# EAGLE board hackeeg-shield (EAGLE 9.5.2)
PCB Matrix Packages
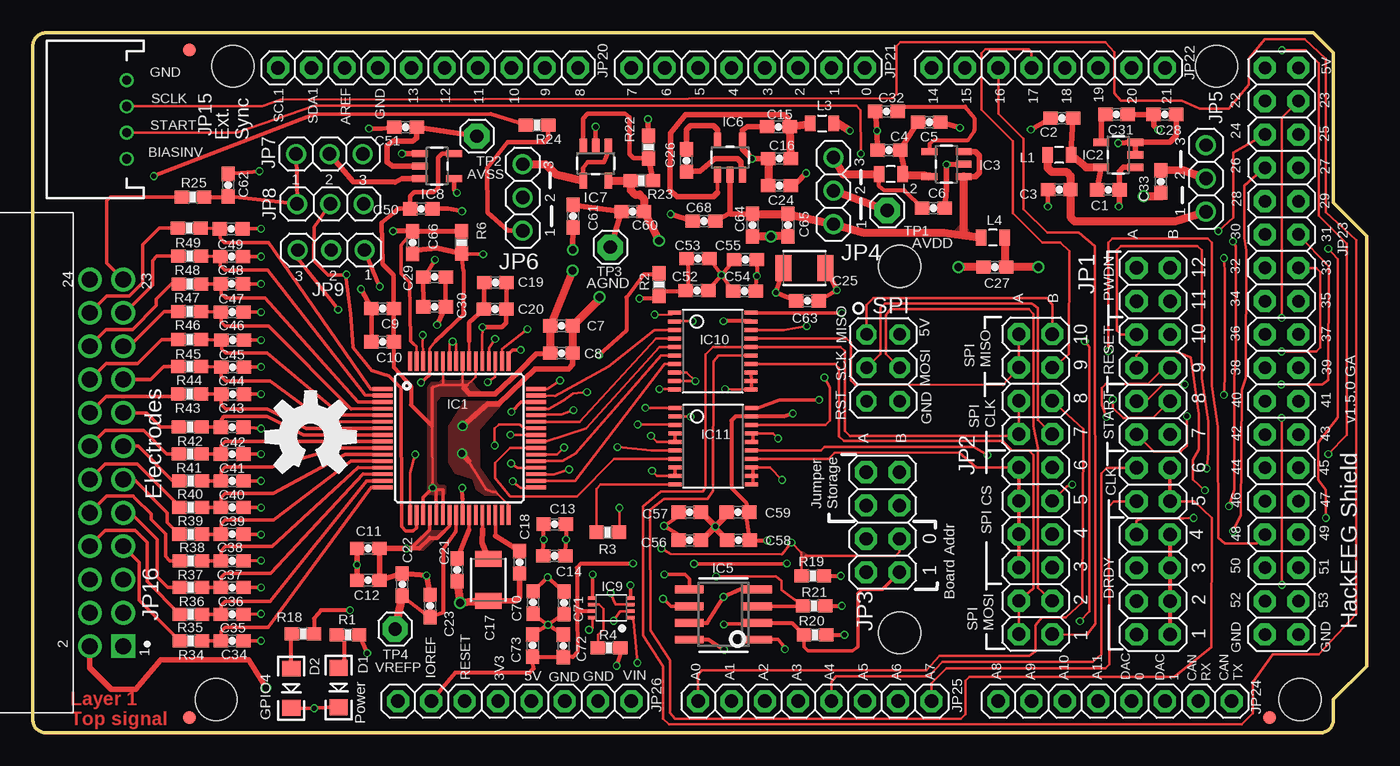
[diagram p3: board, top side]
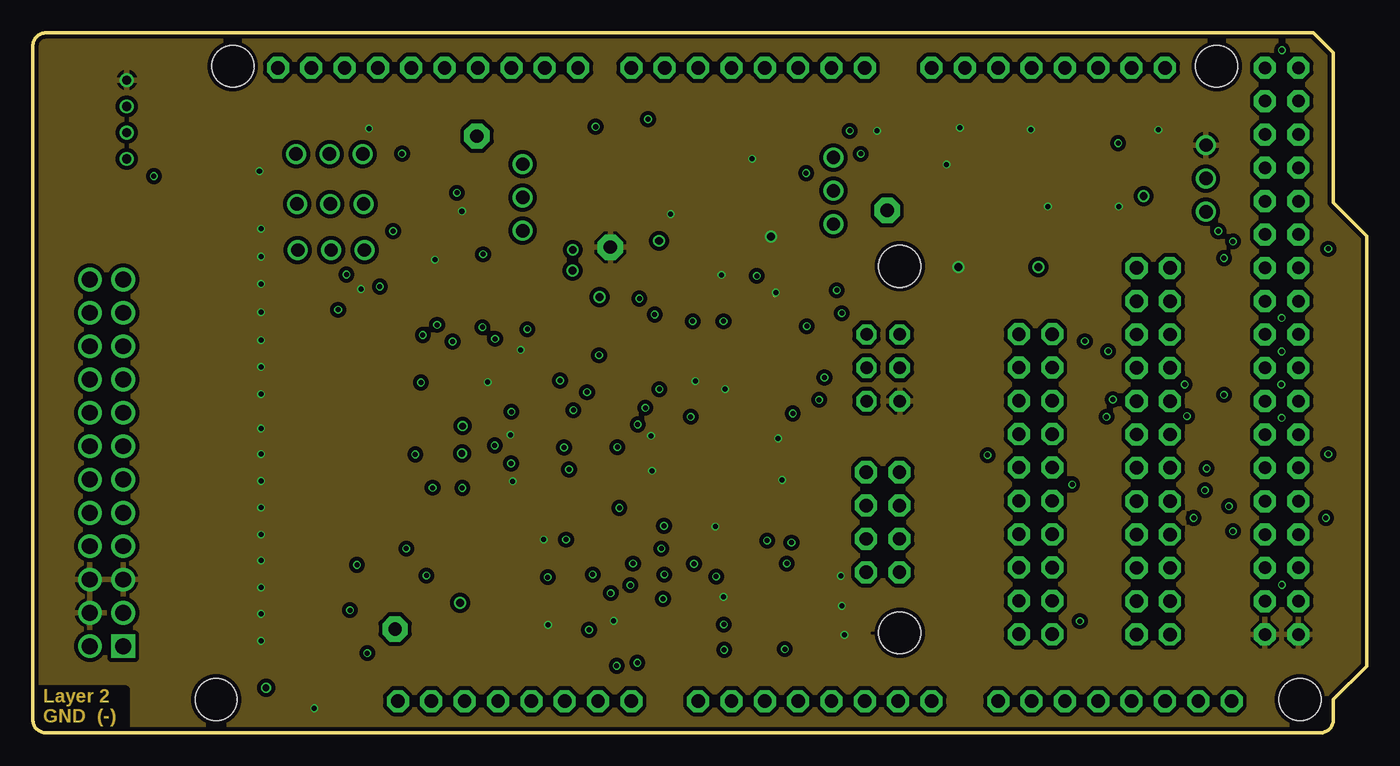
[diagram p4: board, inner layer AGND]
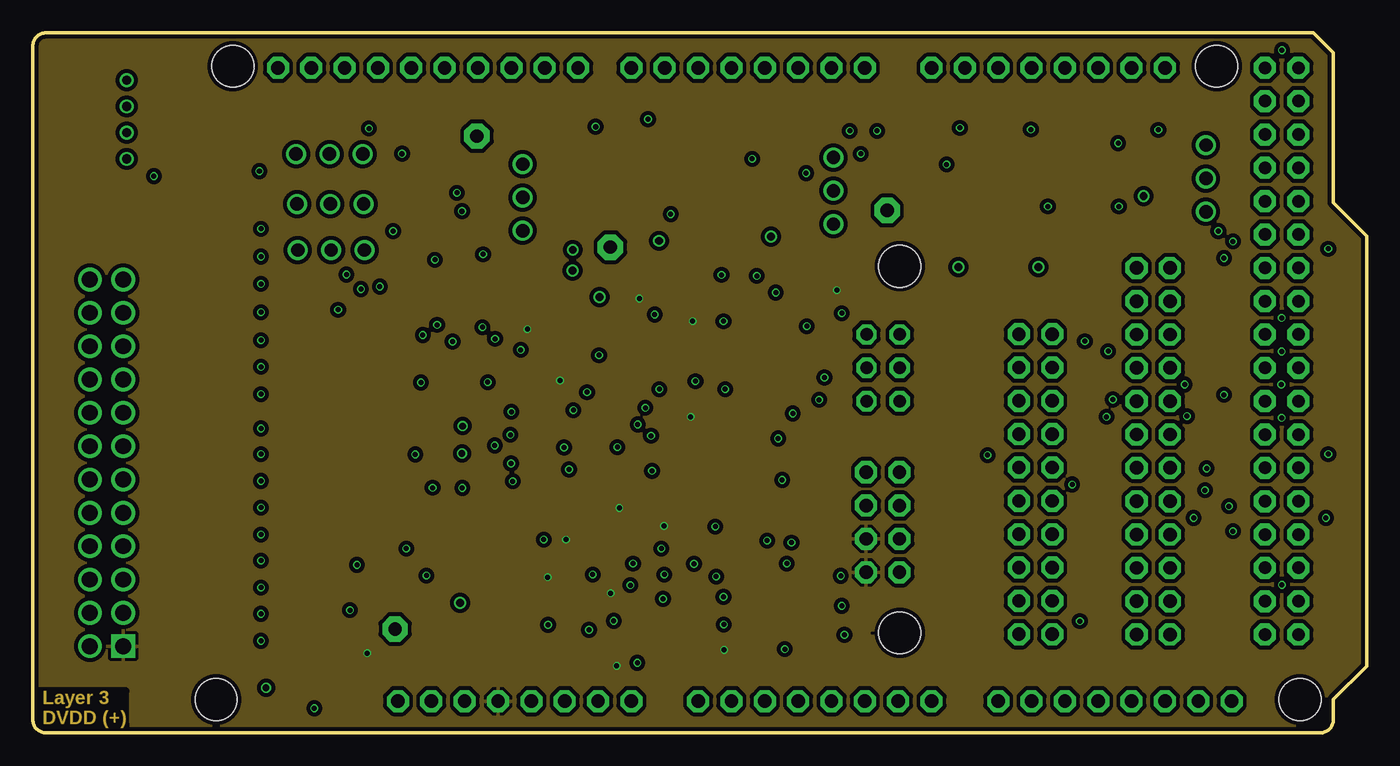
[diagram p5: board, inner layer DVDD]
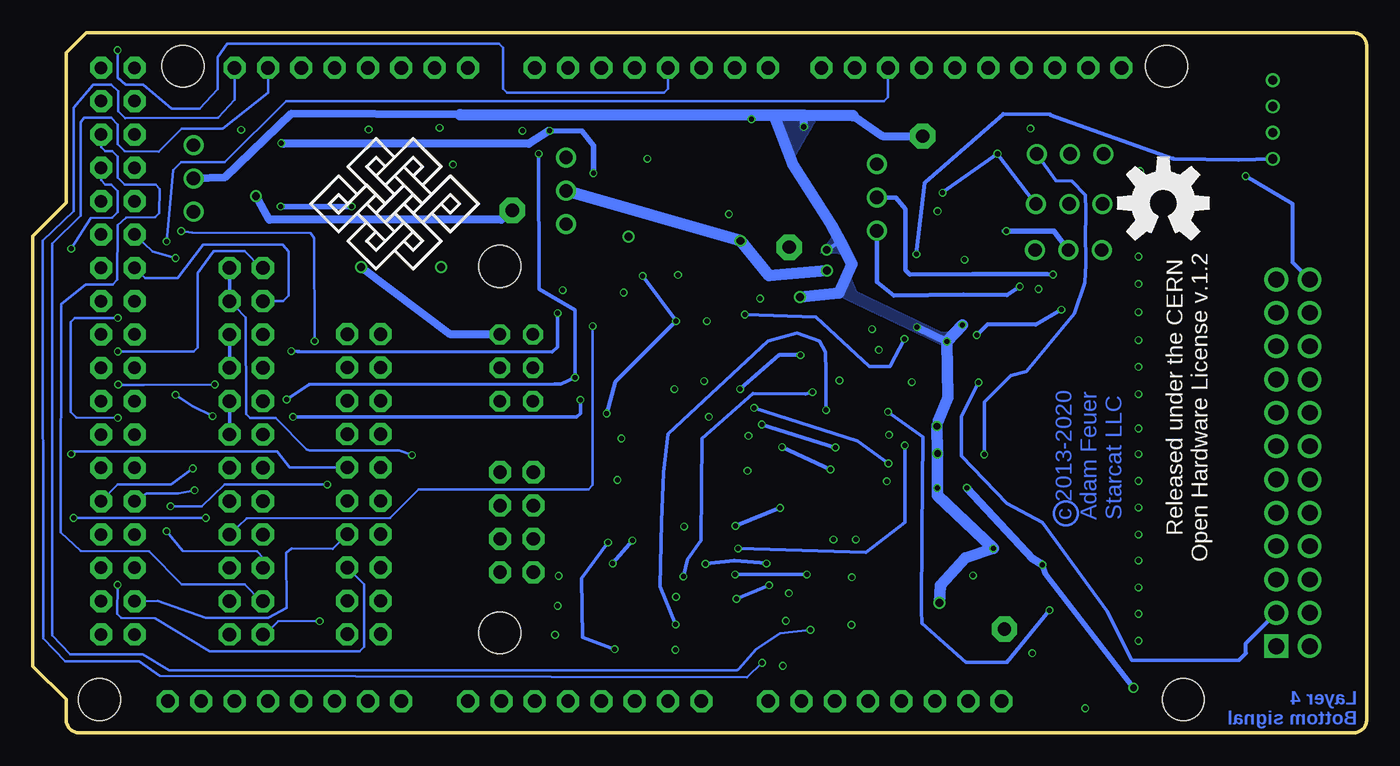
[diagram p6: board, bottom side, seen from below]

Size 101.6 x 53.34 mm. Coordinates in mm from the lower left corner, seen from the top.
Outline: 97.54,53.34 99.06,51.82 99.06,40.39 101.6,37.85 101.6,5.08 99.06,2.54 99.06,1 arc-90 98.06,0 1,0 arc-90 0,1 0,52.34 arc-90 1,53.34 97.54,53.34
Copper layers (1*2*15*16): Top 0.035mm / dielectric 0.23mm / AGND 0.035mm / dielectric 0.93mm / DVDD 0.035mm / dielectric 0.23mm / Bottom 0.035mm
Design rules "MF_Standard_4_Layer": minimum track width 5mil, minimum drill 10mil, track to track 5mil, track to pad 5mil, pad to pad 5mil, via to via 5mil, smd to smd 0mil, copper to edge 10mil, drill to drill 10mil, minimum pad ring 4mil, minimum via ring 4mil, stop-mask expansion 2mil, vias tented up to drill 25mil, thermal gap 10mil
Holes 3.2 mm at 96.52,2.54 15.24,50.8 90.17,50.8 13.97,2.54 66.04,35.56 66.04,7.62

## Footprints (pad centres in the part's own frame; a part is rotated, then mirrored left to right if it is on the bottom)
0603-CAP = smd 1.1 x 1: 1 -0.85,0; 2 0.85,0
1210 = smd 1.2 x 2: 1 -1.6,0; 2 1.6,0
LED-1206 = smd 1.2 x 1.4: A -1.5,0; C 1.5,0
TQFP64 = smd 1.5 x 0.285: 1 -5.85,3.75; 2 -5.85,3.25; 3 -5.85,2.75; 4 -5.85,2.25; 5 -5.85,1.75; 6 -5.85,1.25; 7 -5.85,0.75; 8 -5.85,0.25; 9 -5.85,-0.25; 10 -5.85,-0.75; 11 -5.85,-1.25; 12 -5.85,-1.75; 13 -5.85,-2.25; 14 -5.85,-2.75; 15 -5.85,-3.25; 16 -5.85,-3.75; 33 5.85,-3.75; 34 5.85,-3.25; 35 5.85,-2.75; 36 5.85,-2.25; 37 5.85,-1.75; 38 5.85,-1.25; 39 5.85,-0.75; 40 5.85,-0.25; 41 5.85,0.25; 42 5.85,0.75; 43 5.85,1.25; 44 5.85,1.75; 45 5.85,2.25; 46 5.85,2.75; 47 5.85,3.25; 48 5.85,3.75 | smd 0.285 x 1.5: 17 -3.75,-5.85; 18 -3.25,-5.85; 19 -2.75,-5.85; 20 -2.25,-5.85; 21 -1.75,-5.85; 22 -1.25,-5.85; 23 -0.75,-5.85; 24 -0.25,-5.85; 25 0.25,-5.85; 26 0.75,-5.85; 27 1.25,-5.85; 28 1.75,-5.85; 29 2.25,-5.85; 30 2.75,-5.85; 31 3.25,-5.85; 32 3.75,-5.85; 49 3.75,5.85; 50 3.25,5.85; 51 2.75,5.85; 52 2.25,5.85; 53 1.75,5.85; 54 1.25,5.85; 55 0.75,5.85; 56 0.25,5.85; 57 -0.25,5.85; 58 -0.75,5.85; 59 -1.25,5.85; 60 -1.75,5.85; 61 -2.25,5.85; 62 -2.75,5.85; 63 -3.25,5.85; 64 -3.75,5.85
SOT23-5 = smd 0.55 x 1.2: 1 -0.95,-1.3; 2 0,-1.3; 3 0.95,-1.3; 4 0.95,1.3; 5 -0.95,1.3
SO-08 = smd 0.6 x 2.2: 1 -1.905,-2.6; 2 -0.635,-2.6; 3 0.635,-2.6; 4 1.905,-2.6; 5 1.905,2.6; 6 0.635,2.6; 7 -0.635,2.6; 8 -1.905,2.6
VFSOP-8 = smd 0.25 x 0.65: P$1 -0.75,-1.45; P$2 -0.25,-1.45; P$3 0.25,-1.45; P$4 0.75,-1.45; P$5 0.75,1.45; P$6 0.25,1.45; P$7 -0.25,1.45; P$8 -0.75,1.45
TSSOP20 = smd 0.305 x 0.991: 1 -2.925,-2.918; 2 -2.275,-2.918; 3 -1.625,-2.918; 4 -0.975,-2.918; 5 -0.325,-2.918; 6 0.325,-2.918; 7 0.975,-2.918; 8 1.625,-2.918; 9 2.275,-2.918; 10 2.925,-2.918; 11 2.925,2.918; 12 2.275,2.918; 13 1.625,2.918; 14 0.975,2.918; 15 0.325,2.918; 16 -0.325,2.918; 17 -0.975,2.918; 18 -1.625,2.918; 19 -2.275,2.918; 20 -2.925,2.918
2X12 = drill 1.016 pad 1.676 octagon: 1 -12.7,1.27; 2 -12.7,3.81; 3 -10.16,1.27; 4 -10.16,3.81; 5 -7.62,1.27; 6 -7.62,3.81; 7 -5.08,1.27; 8 -5.08,3.81; 9 -2.54,1.27; 10 -2.54,3.81; 11 0,1.27; 12 0,3.81; 13 2.54,1.27; 14 2.54,3.81; 15 5.08,1.27; 16 5.08,3.81; 17 7.62,1.27; 18 7.62,3.81; 19 10.16,1.27; 20 10.16,3.81; 21 12.7,1.27; 22 12.7,3.81; 23 15.24,1.27; 24 15.24,3.81
2X10 = drill 1.016 pad 1.676 octagon: 1 -11.43,-1.27; 2 -11.43,1.27; 3 -8.89,-1.27; 4 -8.89,1.27; 5 -6.35,-1.27; 6 -6.35,1.27; 7 -3.81,-1.27; 8 -3.81,1.27; 9 -1.27,-1.27; 10 -1.27,1.27; 11 1.27,-1.27; 12 1.27,1.27; 13 3.81,-1.27; 14 3.81,1.27; 15 6.35,-1.27; 16 6.35,1.27; 17 8.89,-1.27; 18 8.89,1.27; 19 11.43,-1.27; 20 11.43,1.27
2X04 = drill 1.016 pad 1.676 octagon: 1 -3.81,-1.27; 2 -3.81,1.27; 3 -1.27,-1.27; 4 -1.27,1.27; 5 1.27,-1.27; 6 1.27,1.27; 7 3.81,-1.27; 8 3.81,1.27
1X03 = drill 1.016: 1 -2.54,0; 2 0,0; 3 2.54,0
JST-4-PTH = drill 0.7: 1 -3,-5; 2 -1,-5; 3 1,-5; 4 3,-5
OST_302-R241 = drill 1.2 square: 1 13.97,1.27 | drill 1.2: 2 13.97,-1.27; 3 11.43,1.27; 4 11.43,-1.27; 5 8.89,1.27; 6 8.89,-1.27; 7 6.35,1.27; 8 6.35,-1.27; 9 3.81,1.27; 10 3.81,-1.27; 11 1.27,1.27; 12 1.27,-1.27; 13 -1.27,1.27; 14 -1.27,-1.27; 15 -3.81,1.27; 16 -3.81,-1.27; 17 -6.35,1.27; 18 -6.35,-1.27; 19 -8.89,1.27; 20 -8.89,-1.27; 21 -11.43,1.27; 22 -11.43,-1.27; 23 -13.97,1.27; 24 -13.97,-1.27
1X10 = drill 1.016 pad 1.676 octagon: 1 -11.43,0; 2 -8.89,0; 3 -6.35,0; 4 -3.81,0; 5 -1.27,0; 6 1.27,0; 7 3.81,0; 8 6.35,0; 9 8.89,0; 10 11.43,0
1X08 = drill 1.016 pad 1.676 octagon: 1 -8.89,0; 2 -6.35,0; 3 -3.81,0; 4 -1.27,0; 5 1.27,0; 6 3.81,0; 7 6.35,0; 8 8.89,0
2X18 = drill 0.95 pad 1.676 octagon: 1 -21.59,-1.27; 2 -21.59,1.27; 3 -19.05,-1.27; 4 -19.05,1.27; 5 -16.51,-1.27; 6 -16.51,1.27; 7 -13.97,-1.27; 8 -13.97,1.27; 9 -11.43,-1.27; 10 -11.43,1.27; 11 -8.89,-1.27; 12 -8.89,1.27; 13 -6.35,-1.27; 14 -6.35,1.27; 15 -3.81,-1.27; 16 -3.81,1.27; 17 -1.27,-1.27; 18 -1.27,1.27; 19 1.27,-1.27; 20 1.27,1.27; 21 3.81,-1.27; 22 3.81,1.27; 23 6.35,-1.27; 24 6.35,1.27; 25 8.89,-1.27; 26 8.89,1.27; 27 11.43,-1.27; 28 11.43,1.27; 29 13.97,-1.27; 30 13.97,1.27; 31 16.51,-1.27; 32 16.51,1.27; 33 19.05,-1.27; 34 19.05,1.27; 35 21.59,-1.27; 36 21.59,1.27
0805 = smd 0.8 x 1.2: 1 -0.9,0; 2 0.9,0
0603-RES = smd 1.1 x 1: 1 -0.85,0; 2 0.85,0
2X03 = drill 0.95 pad 1.55 octagon: 1 -2.54,-1.27; 2 -2.54,1.27; 3 0,-1.27; 4 0,1.27; 5 2.54,-1.27; 6 2.54,1.27
1X01 = drill 1.016 pad 1.93 octagon: 1 0,0
FIDUCIAL_1MM = smd 1 x 1: 1 0,0

## Placement (x,y rotation side)
C1  2.2uF  [0603-CAP]  81.92,41.38 0 top
C2  10 uF  [0603-CAP]  78.38,46.84 180 top
C3  10uF  [0603-CAP]  78.18,41.4 180 top
C4  2.2uF  [0603-CAP]  65.2,44.4 180 top
C5  10 uF  [0603-CAP]  68.28,46.53 0 top
C6  10uF  [0603-CAP]  68.61,39.98 0 top
C7  1uF  [0603-CAP]  40.26,31.01 0 top
C8  0.1uF  [0603-CAP]  40.26,28.93 0 top
C9  1uF  [0603-CAP]  26.64,32.33 180 top
C10  0.1uF  [0603-CAP]  26.64,29.79 180 top
C11  1uF  [0603-CAP]  25.55,14.05 0 top
C12  0.1uF  [0603-CAP]  25.55,11.63 0 top
C13  1uF  [0603-CAP]  39.75,15.9 180 top
C14  0.1uF  [0603-CAP]  39.73,13.49 180 top
C15  1uF  [0603-CAP]  56.79,46.18 180 top
C16  10 uF  [0603-CAP]  56.87,43.76 180 top
C17  100uF  [1210]  34.7,11.66 270 top
C18  1uF  [0603-CAP]  37.08,13 270 top
C19  1uF  [0603-CAP]  35.23,34.32 0 top
C20  0.1uF  [0603-CAP]  35.2,32.28 0 top
C21  1uF  [0603-CAP]  32.31,12.41 270 top
C22  10uF  [0603-CAP]  28.14,11.3 90 top
C23  0.1uF  [0603-CAP]  30.25,9.67 90 top
C24  10uF  [0603-CAP]  56.87,41.71 180 top
C25  100uF  [1210]  58.78,35.41 180 top
C26  1uF  [0603-CAP]  49.78,43.61 90 top
C27  10uF  [0603-CAP]  73.28,35.48 180 top
C28  2.2uF  [0603-CAP]  86.23,47.12 180 top
C29  1uF  [0603-CAP]  30.6,34.74 0 top
C30  1uF  [0603-CAP]  30.61,32.47 0 top
C31  0.01uF  [0603-CAP]  82.55,47.12 0 top
C32  1uF  [0603-CAP]  65.02,47.35 180 top
C33  0.1uF  [0603-CAP]  85.93,42.01 90 top
C34  4.7nF  [0603-CAP]  15.19,7.01 0 top
C35  4.7nF  [0603-CAP]  15.19,9.04 180 top
C36  4.7nF  [0603-CAP]  15.19,11.07 0 top
C37  4.7nF  [0603-CAP]  15.19,13.11 180 top
C38  4.7nF  [0603-CAP]  15.19,15.14 0 top
C39  4.7nF  [0603-CAP]  15.19,17.17 180 top
C40  4.7nF  [0603-CAP]  15.19,19.2 0 top
C41  4.7nF  [0603-CAP]  15.19,21.23 180 top
C42  4.7nF  [0603-CAP]  15.19,23.29 0 top
C43  4.7nF  [0603-CAP]  15.21,25.81 180 top
C44  4.7nF  [0603-CAP]  15.21,27.86 0 top
C45  4.7nF  [0603-CAP]  15.21,29.92 180 top
C46  4.7nF  [0603-CAP]  15.19,32.05 0 top
C47  4.7nF  [0603-CAP]  15.16,34.21 180 top
C48  4.7nF  [0603-CAP]  15.14,36.3 0 top
C49  4.7nF  [0603-CAP]  15.11,38.4 180 top
C50  1uF  [0603-CAP]  29.59,39.93 0 top
C51  1uF  [0603-CAP]  28.4,46.15 0 top
C52  1uF  [0603-CAP]  50.6,33.71 180 top
C53  0.1uF  [0603-CAP]  50.67,36.14 180 top
C54  1uF  [0603-CAP]  54.2,33.65 0 top
C55  0.1uF  [0603-CAP]  54.28,36.07 0 top
C56  1uF  [0603-CAP]  50.04,14.68 180 top
C57  0.1uF  [0603-CAP]  50.04,16.81 180 top
C58  1uF  [0603-CAP]  53.75,14.68 0 top
C59  0.1uF  [0603-CAP]  53.72,16.81 0 top
C60  1uF  [0603-CAP]  45.69,39.73 180 top
C61  1uF  [0603-CAP]  41.15,39.37 270 top
C62  4.7nF  [0603-CAP]  14.88,41.74 90 top
C63  0.1uF  [0603-CAP]  59,32.92 180 top
C64  10uF  [0603-CAP]  54.81,38.68 270 top
C65  1uF  [0603-CAP]  57.53,38.68 270 top
C66  0.01uF  [0603-CAP]  28.94,37.36 270 top
C68  1uF  [0603-CAP]  51.13,38.99 180 top
C70  1uF  [0603-CAP]  38.1,9.93 90 top
C71  0.1uF  [0603-CAP]  40.46,9.91 90 top
C72  1uF  [0603-CAP]  40.41,6.63 270 top
C73  0.1uF  [0603-CAP]  38.07,6.65 270 top
D1  RED  [LED-1206]  23.29,3.45 270 top
D2  BLUE  [LED-1206]  19.69,3.4 270 top
IC1  ADS1299IPAG  [TQFP64]  32.49,22.45 0 top
IC2  TPS72325DBVT  [SOT23-5]  82.68,44.04 90 top
IC3  TPS73225DBVT  [SOT23-5]  69.6,43.33 90 top
IC5  24AA256UID  [SO-08]  52.6,9.02 90 top
IC6  TPS60403DBVT  [SOT23-5]  53.11,43.84 0 top
IC7  OPA376DBV  [SOT23-5]  42.88,43.38 180 top
IC8  OPA376DBV  [SOT23-5]  30.78,43.18 270 top
IC9  TXS0102DCUR  [VFSOP-8]  44.07,9.52 90 top
IC10  TXB0108PWR  [TSSOP20]  51.79,29.08 270 top
IC11  TXB0108PWR  [TSSOP20]  51.82,21.84 270 top
JP1  CONFIG1  [2X12]  87.88,20.19 90 top
JP2  CONFIG0  [2X10]  76.38,18.95 270 top
JP3  BOARD_ADDRESS  [2X04]  64.74,16.05 90 top
JP4  5V-2.5V  [1X03]  60.99,41.3 90 top
JP5  -2.5V-GND  [1X03]  89.36,42.24 90 top
JP6  SRB1-BIAS  [1X03]  37.31,40.79 90 top
JP7  SRB2-REF_ELEC  [1X03]  22.59,44.1 0 top
JP8  SRB1-REF_ELEC  [1X03]  22.66,40.3 0 top
JP9  BIASOUT_BIASIN_BIAS_ELEC  [1X03]  22.73,36.79 180 top
JP15  External Sync  [JST-4-PTH]  2.16,46.74 90 top
JP16  Electrodes  [OST_302-R241]  5.61,20.57 270 top
JP20  PWMH  [1X10]  30.1,50.67 0 top
JP21  PWML  [1X08]  54.48,50.67 0 top
JP22  COMMUNICATION  [1X08]  77.34,50.67 0 top
JP23  XIO  [2X18]  95.12,29.08 270 top
JP24  ADCH  [1X08]  82.42,2.41 0 top
JP25  ADCL  [1X08]  59.56,2.41 0 top
JP26  POWER  [1X08]  36.7,2.41 0 top
L1  3.3 uH  [0805]  78.18,44.04 180 top
L2  3.3 uH  [0805]  65.35,42.57 180 top
L3  3.3 uH  [0805]  60.12,46.43 0 top
L4  3.3 uH  [0805]  73.13,37.74 180 top
R1  270  [0603-RES]  24,7.47 180 top
R2  10k  [0603-RES]  47.7,34.16 90 top
R3  10k  [0603-RES]  43.79,15.29 180 top
R4  10k  [0603-RES]  43.89,6.48 180 top
R6  3.98K  [0603-RES]  32.65,37.37 90 top
R18  270  [0603-RES]  20.57,7.54 180 top
R19  10k  [0603-RES]  59.41,11.96 180 top
R20  10k  [0603-RES]  59.59,7.47 180 top
R21  10k  [0603-RES]  59.51,9.68 180 top
R22  2M  [0603-RES]  46.89,44.63 90 top
R23  2M  [0603-RES]  46.38,42.09 0 top
R24  4.99k  [0603-RES]  38.4,46.3 0 top
R25  4.99k  [0603-RES]  12.19,40.82 180 top
R34  4.99k  [0603-RES]  12.04,7.01 0 top
R35  4.99k  [0603-RES]  12.04,9.04 0 top
R36  4.99k  [0603-RES]  12.04,11.07 0 top
R37  4.99k  [0603-RES]  12.04,13.11 0 top
R38  4.99k  [0603-RES]  12.01,15.14 0 top
R39  4.99k  [0603-RES]  12.01,17.17 0 top
R40  4.99k  [0603-RES]  12.01,19.2 0 top
R41  4.99k  [0603-RES]  11.99,21.26 0 top
R42  4.99k  [0603-RES]  11.99,23.32 0 top
R43  4.99k  [0603-RES]  11.94,25.83 0 top
R44  4.99k  [0603-RES]  11.94,27.91 0 top
R45  4.99k  [0603-RES]  11.94,29.97 0 top
R46  4.99k  [0603-RES]  11.94,32.11 0 top
R47  4.99k  [0603-RES]  11.96,34.19 0 top
R48  4.99k  [0603-RES]  11.94,36.32 0 top
R49  4.99k  [0603-RES]  11.91,38.46 0 top
SPI  SPI  [2X03]  64.77,27.81 270 top
TP1  AVDD_TEST_POINT  [1X01]  65.07,39.8 90 top
TP2  AVSS_TEST_POINT  [1X01]  33.83,45.47 0 top
TP3  AGND_TEST_POINT  [1X01]  43.99,37.01 0 top
TP4  VREFP_TEST_POINT  [1X01]  27.59,7.91 0 top
U$1  [OSHW-LOGO-L]  21.16,22.56 0 top
U$2  FIDUCIAL  [FIDUCIAL_1MM]  11.91,1.17 0 top
U$4  [OSHW-LOGO-L]  15.49,40.36 0 bottom
U$5  FIDUCIAL  [FIDUCIAL_1MM]  11.91,52.04 0 top
U$6  FIDUCIAL  [FIDUCIAL_1MM]  94.21,1.17 0 top
U$7  [ENDLESSKNOT-MEDIUM]  73.94,40.26 0 bottom

## Tracks (layer width: path | path; a pad name or v marks a point on that pad's centre or on a via)
!ADC_CS_0  (via drill 0.38)
  Top 0.203: v98.68,21.23 100.1,22.68 100.1,37.26 97.94,39.42 97.97,48.67 97.97,51.03 96.98,52.02 v95.15,52.02
  Bottom 0.203: v98.68,21.23 98.48,21.44 83.01,21.44 82.04,20.22 JP2.10 | JP21.4 53.21,49.09 53.53,48.77 65.47,48.77 65.79,49.09 65.79,52.21 66.1,52.53 67.35,52.53 86.79,52.5 87.53,51.49 87.5,49.06 88.89,47.55 91.03,47.55 93.19,49.38 94.51,49.38 95.12,49.94 95.12,51.89 v95.15,52.02
!ADC_CS_1  (via drill 0.38)
  Top 0.203: v79.17,18.92 78.77,18.8 JP2.12 | v91.11,17.27 91.52,18.52 91.52,27 91.62,28.42 91.62,37.08 v91.42,37.44
  Bottom 0.203: v79.17,18.92 87,18.92 88.72,17.27 v91.11,17.27 | v91.42,37.44 90.91,42.86 90.28,43.48 86.97,43.48 82.3,48.13 36.77,48.13 36.45,48.45 JP20.8
!ADC_CS_2
  Bottom 0.203: JP2.14 78.77,14.02 81.9,14.05 82.3,13.73 82.27,9.52 83.69,8.76 88.42,8.76 92.08,10.06 JP23.33
!ADC_CS_3  (via drill 0.38)
  Top 0.203: JP23.4 95.12,46.86 v95.12,31.62 | v95.12,24 95.12,23.5 v95.15,11.28
  Bottom 0.203: JP2.16 76.38,11.33 76.38,6.54 76.7,6.22 88.12,6.22 92.28,8.74 94.85,8.75 95.17,9.07 v95.15,11.28 | v95.12,24 98.31,24.03 98.73,24.45 98.73,31.31 98.41,31.62 v95.12,31.62
!ADC_PWDN_0
  Bottom 0.203: JP23.13 93.04,34.65 90.55,34.65 88.62,37.19 82.58,37.21 82.12,36.65 82.12,33.31 82.54,32.89 JP1.22
!ADC_PWDN_1  (via drill 0.38)
  Top 0.203: JP23.14 97.75,35.43 98.07,35.11 98.07,29.38 97.75,29.06 v95.12,29.06
  Bottom 0.152: 84.2,35.43 JP1.24
  Bottom 0.203: 84.2,35.43 85.47,36.7 87.81,36.7 89.03,35.05 89.03,29.38 89.34,29.06 v95.12,29.06
!ADC_RESET_0  (via drill 0.38)
  Top 0.203: v89.28,18.49 88.37,19.3 88.37,20.8 88.82,21.59 88.82,24.28 88.19,28.6 87,29.08 84.39,29.08 84.07,28.77 JP1.18
  Bottom 0.203: v89.28,18.49 90.53,18.26 92.91,18.26 JP23.27
!ADC_RESET_1  (via drill 0.38)
  Top 0.203: v89.41,20.14 89.54,21.36 89.54,23.72 89.03,27.05 89.03,36.77 88.71,37.08 82.89,37.08 82.58,36.77 82.58,30.67 82.89,30.35 JP1.20
  Bottom 0.203: JP23.28 95.12,18.92 91.06,18.95 v89.41,20.14
!ADS_PWDN  (via drill 0.38)
  Top 0.203: IC11.15 54.8,21.51 60.05,21.51 60.3,21.79 71.68,21.79 v72.72,21.16
  Bottom 0.203: JP1.21 86.2,32.49 85.4,31.64 85.34,24.3 85.03,23.98 83.11,23.98 80.74,21.61 80.51,21.51 73.69,21.51 v72.72,21.16
  Bottom 0.254: JP1.23 JP1.21
!ADS_RESET  (via drill 0.38)
  Top 0.203: JP1.17 86.13,27.81 84.91,26.59 81.75,26.59 81.43,26.28 81.43,24.97 81.77,24.09 v81.79,24.08
  Top 0.254: IC11.20 55.22,24.77 56.87,25.38 v59.89,25.38
  Bottom 0.254: JP1.19 JP1.17 | v59.89,25.38 59.89,24.35 60.18,24.05 66.04,24.05 v81.79,24.08
!ADS_SPI_CS
  Top 0.203: JP2.9 71.86,20.22 70.54,21.36 61.06,21.34 60.59,20.87 IC11.14
  Top 0.254: JP2.9 JP2.11 JP2.13 JP2.15
!PWDN  (via drill 0.38)
  Top 0.203: IC11.6 47.12,21.51 v44.53,21.77 | v40.84,20.07 39.69,19.7 IC1.35
  Bottom 0.305: v44.53,21.77 v40.84,20.07
!RESET  (via drill 0.38)
  Top 0.203: IC11.1 v46.66,24.77 | v36.42,20.52 36.91,20.19 IC1.36
  Bottom 0.254: v46.66,24.77 38.79,22.23 v36.42,20.52
!SPI_CS
  Top 0.203: IC11.7 44.27,20.88 41.45,18.01 36.34,18.01 35.2,19.44 35.2,20.57 36.34,21.7 IC1.39
+2.5V
  Top 0.305: C6.1 66.41,41.33 64.87,41.33 64.45,41.64 L2.2
  Top 0.61: JP4.3 61.72,42.57 L2.2
-2.5V
  Top 0.61: JP5.1 87.02,38.99 79.35,38.99 79.03,39.31 C3.1 79.03,42.43 78.71,42.75 77.6,42.75 77.28,43.07 L1.2
ADC_CLK_0
  Top 0.203: JP1.10 82.33,17.65 81.97,17.21 82.02,5.22 81.7,4.9 69.6,4.9 68.45,3.76 JP25.8
ADC_CLK_1
  Top 0.203: JP1.12 81.8,20.19 81.41,19.77 81.41,5.98 80.73,5.41 69.29,5.41 68.25,4.29 61.18,4.29 60.83,3.9 JP25.5
ADC_DRDY_0  (via drill 0.38)
  Top 0.203: v79.76,8.51 80.47,9.27 80.47,29.41 v80.14,29.85 | v90.3,38.23 91.44,39.24 91.44,44.2 JP23.5
  Bottom 0.152: v79.76,8.51 82.93,8.51 83.95,7.49 JP1.2
  Bottom 0.203: v80.14,29.85 80.16,37.68 80.45,38.07 89.46,38.1 v90.3,38.23
ADC_DRDY_1
  Bottom 0.203: JP1.4 84.2,10.03 85.47,11.3 90.27,11.3 92.73,13.84 97.97,13.87 99.47,15.26 99.44,32.66 97.56,34.16 95.5,34.16 95.16,34.55 95.15,38.69 94.48,39.26 92.28,39.29 91.97,39.6 91.93,41.44 92.24,41.76 94.61,41.78 95.13,42.3 95.15,43.9 95.57,44.32 96.08,44.32 96.39,44.64 JP23.6
ADC_DRDY_2  (via drill 0.38)
  Top 0.203: JP23.7 92.28,41.71 92.28,37.74 92.43,36.75 92.41,27.03 92.08,26.12 92.02,16.61 v91.42,15.37
  Bottom 0.203: JP1.6 84.07,13.35 84.52,13.84 90.2,13.87 v91.42,15.37
ADC_DRDY_3  (via drill 0.38)
  Top 0.203: JP1.8 84.07,16.14 84.49,16.36 87.63,16.36 v88.42,16.38 | v98.5,16.38 98.48,18.52 97.92,19.28 97.92,22.12 99.42,24.03 99.42,36.09 v98.67,36.88
  Bottom 0.203: v88.42,16.38 v98.5,16.38 | JP23.8 96.39,42.1 96.08,41.78 95.64,41.78 95.12,41.26 95.12,39.66 95.54,39.24 97.18,39.22 v98.67,36.88
ADC_START_0  (via drill 0.38)
  Top 0.203: v90.73,25.76 90.81,27.05 90.8,35.25 v90.73,36.17 | JP1.14 85.37,21.44 87.43,21.44 87.91,21.87 v87.91,24.13
  Bottom 0.203: v90.73,25.76 89.46,24.92 v87.91,24.13 | JP23.11 92.48,36.68 v90.73,36.17
ADC_START_1  (via drill 0.38)
  Top 0.203: v87.73,26.54 86.08,26.54 84.81,25.27 JP1.16 | JP23.12 98.7,35.53 98.68,26.89 98.23,26.54 v95.1,26.54
  Bottom 0.203: v87.73,26.54 93.15,26.52 95.07,26.52 v95.1,26.54
ADS_CLK
  Top 0.203: IC10.15 52.21,28.76 51.84,28.31 51.82,18.45 51.4,17.83 48.09,17.83 47.02,17.01 47.04,7.82 48.54,5.54 48.54,1.54 48.93,1.09 70.7,1.09 71.02,1.41 71.02,3.95 71.34,4.27 86.94,4.27 86.97,4.29 89.76,6.53 89.79,16.4 88.45,17.65 JP1.9
  Top 0.254: JP1.9 JP1.11
ADS_CLKSEL  (via drill 0.38)
  Top 0.203: IC10.20 54.74,31.98 | JP23.29 93.24,14.45 90.79,14.45 90.3,14.87 90.27,23.29 89.81,26.47 89.81,37.35 89.5,37.67 82.23,37.67 81.92,37.35 v81.92,29.08
  Top 0.254: 54.74,31.98 v61.62,31.98
  Bottom 0.254: v61.62,31.98 61.62,29.4 62.04,29.03 81.33,29.06 81.42,29.06 v81.92,29.08
ADS_DRDY  (via drill 0.38)
  Top 0.203: IC10.18 54.68,30.68 57.23,30.68 v58.95,30.99
  Top 0.305: JP1.7 JP1.5 JP1.3 JP1.1
  Bottom 0.203: JP1.7 85.29,16.36 74.37,16.38 72.21,18.57 59.27,18.57 58.95,18.89 v58.95,30.99
ADS_SPI_CLK
  Top 0.203: JP2.5 JP2.7 74.65,22.63 62.24,22.63 61.85,23 61.85,29.09 61.53,29.41 IC10.16 51.8,29.41 51.23,28.84 51.23,18.71 51.04,18.39 47.84,18.39 46.48,17.26 46.48,7.44 48.01,5.06 48.01,1.08 48.48,0.66 92.09,0.66 92.94,1.51 92.94,3.83 94.46,5.97 97.94,5.97 100.81,9.07 100.81,37.54 98.48,39.67 98.48,51.36 96.88,52.86 93.84,52.86 92.61,51.38 92.61,49.4 91.11,47.55 88.88,47.55 87.5,48.18 82.89,48.18 82.4,48.73 82.4,51.85 81.7,52.63 66.1,52.63 65.79,52.31 65.79,48.68 65.47,48.36 18.87,48.26 17.46,47.75 JP15.3
ADS_SPI_IN
  Top 0.203: JP2.19 JP2.17 76.2,11 76.2,21.17 75.86,21.51 74.6,21.51 73.89,22.23 61.79,22.23 61.42,22.59 61.42,27.79 61.1,28.11 IC10.14
ADS_SPI_OUT
  Top 0.203: JP2.1 JP2.3 73.89,26.52 64.39,26.54 62.62,26.54 62.31,26.86 62.31,29.74 61.99,30.06 IC10.17
ADS_START  (via drill 0.38)
  Top 0.203: v63.07,44.12 63.04,47.46 62.72,47.78 21.46,47.8 15.54,45.74 9.02,45.74 JP15.2 | IC11.18 60.39,23.47 60.71,23.79 60.71,26.31 v60.3,27.08 | JP1.15 85.32,23.98 83.06,23.98 82.27,24.77 v82.27,25.4
  Bottom 0.254: JP1.15 JP1.13 | v82.27,25.4 80.57,26.54 61.87,26.57 61.37,26.59 v60.3,27.08 60.3,32.21 63.04,33.83 v63.07,44.12
AGND  (via drill 0.38, 0.41, 0.6, 0.61)
  Top 0.152: 54.86,22.23 IC11.16 | 54.86,22.73 IC11.17 | 54.86,19.69 IC11.12 54.86,19.43 | 54.86,20.19 IC11.13 | 54.74,26.29 IC10.11 | 54.74,26.8 IC10.12 | 54.86,18.92 IC11.11
  Top 0.203: v52.73,26.19 53.27,26.16 IC10.11 | IC1.41 v36.37,22.71 | C57.1 51.28,16.74 51.18,16.84 | IC1.33 38.3,18.67 37.16,18.67 v36.55,19.18 | IC10.9 49.14,26.81 49.15,26.8 v50.47,26.8 49.81,27.46 IC10.8 | IC11.9 47.56,19.57 v47.17,19.96 | IC11.5 47.55,22.17 v47.09,22.63 | IC11.13 56.13,20.22 v57.07,19.28 | IC11.17 56.38,22.82 v56.77,22.43 | IC1.51 35.2,27.13 v34.65,26.72 | IC9.P$2 44.73,9.27 v44.25,8.53
  Top 0.254: 54.86,22.73 54.86,22.23 | 54.86,20.19 54.86,19.69 | 54.74,26.29 54.74,26.8 IC10.13 | 54.86,18.92 54.86,19.43 | IC11.4 IC11.5 | IC11.8 IC11.9 | v56.21,37.83 v56.21,37.82 | C34.2 v17.37,7.01 | C35.1 v17.37,9.07 | C36.2 v17.37,11.07 | C37.1 v17.37,13.13 | C38.2 v17.37,15.11 | C39.1 v17.37,17.17 | C40.2 v17.37,19.2 | C41.1 v17.37,21.23 | C42.2 v17.37,23.19 | C43.1 v17.37,25.81 | C44.2 v17.37,27.89 | C45.1 v17.37,29.92 | C46.2 v17.37,32.05 | C47.1 v17.37,34.21 | C48.2 v17.37,36.3 | C49.1 v17.37,38.4 | v37.16,29.19 36.55,29.19 36.24,28.87 IC1.49
  Top 0.305: D1.C v21.44,1.88 D2.C | C53.1 v52.45,34.9 | C52.1 v52.45,34.9 | C55.1 v52.45,34.9 | C54.1 v52.45,34.9 | C62.2 v17.26,42.8 | C13.2 v38.91,14.73 C14.2 | C70.1 v39.24,8.23 | C73.1 v39.24,8.23 | C72.1 v39.24,8.23 | C71.1 v39.24,8.23 | IC5.7 51.36,8.38 v52.6,10.36 53.9,10.92 IC5.4 | R19.1 v61.54,11.96 | R21.1 v61.62,9.68 | R20.1 v61.82,7.47
  Top 0.356: v24.99,33.82 C9.2 C10.2 | C3.2 v77.32,40.11 | C51.1 26.59,46.05 v25.61,46.05 | C30.1 C29.1 30.08,35.13 v30.63,36.04 | C25.2 v56.59,33.55 C63.2 | C50.2 31.64,39.95 v32.68,39.75
  Top 0.406: IC3.2 v69.6,43.31 69.6,41.44 C6.2 | C2.2 v76.02,45.97 | C16.2 v54.79,43.74 54.06,44.46 IC6.4 54.06,45.94 54.43,46.18 C15.2 | C32.2 v64.31,45.87 C4.2 | C31.2 C28.2 85.38,46.27 v85.73,45.95 | v82.73,40.11 82.77,40.04 C1.2 82.77,42.78 83.08,43.09 IC2.1 | C27.2 72.34,35.48 | C68.2 v48.59,39.52 | C5.2 v70.61,46.1 | 51.18,16.84 51.18,16.52 v51.98,15.72 | v51.98,15.72 51.98,15.6 C58.1 | C56.1 50.94,14.68 v51.98,15.72 | C59.1 52.87,16.61 v51.98,15.72 | C61.1 C60.2 TP3.1
  Top 0.61: C16.2 C24.2 | C64.2 v56.21,37.83 C65.2 | 72.34,35.48 v70.51,35.48
  AGND 0.356: v56.59,33.55 56.52,33.35
  Bottom 0.406: v77.32,40.11 v82.73,40.11
  pour AGND (isolate 0.305): 0.28,52.22 0.25,1.12 0.25,1.04 arc90 1.12,0.3 98.32,0.25 arc90 98.83,0.76 98.76,2.72 101.32,5.23 101.27,37.69 98.7,40.34 98.76,51.64 97.36,53.09 2.16,53.01 1.63,53.01 arc90
AIN1N
  Top 0.254: R35.2 C35.2 14.34,9.71 14.66,10.03 18.06,10.03 25.43,19.2 IC1.15
AIN1P
  Top 0.254: R34.2 C34.1 14.34,7.73 14.66,8.05 17.91,8.05 25.76,18.69 IC1.16
AIN2N
  Top 0.254: R37.2 C37.2 14.34,13.88 14.66,14.2 18.24,14.2 24.79,20.22 IC1.13
AIN2P
  Top 0.254: R36.2 C36.1 14.34,11.85 14.66,12.17 18.11,12.17 25.15,19.71 IC1.14
AIN3N
  Top 0.254: R39.2 C39.2 14.34,17.95 14.66,18.26 18.29,18.26 23.8,21.21 IC1.11
AIN3P
  Top 0.254: R38.2 C38.1 14.34,15.91 14.66,16.23 18.33,16.23 24.25,20.7 IC1.12
AIN4N
  Top 0.254: R41.2 C41.2 14.34,21.88 14.66,22.2 22.23,22.2 IC1.9
AIN4P
  Top 0.254: R40.2 C40.1 14.34,19.93 14.66,20.24 18.21,20.24 23.24,21.72 IC1.10
AIN5N
  Top 0.254: R43.2 C43.2 14.37,25.01 14.68,24.69 17.86,24.69 20.8,23.19 IC1.7
AIN5P
  Top 0.254: R42.2 C42.1 14.34,23.79 14.55,24.11 17.83,24.11 20.62,22.71 IC1.8
AIN6N
  Top 0.254: IC1.5 23.47,24.21 17.86,28.93 14.71,28.93 14.39,29.25 C45.2 R45.2
AIN6P
  Top 0.254: R44.2 C44.1 14.37,27.14 14.68,26.82 18.09,26.82 22.28,23.72 IC1.6
AIN7N
  Top 0.254: R47.2 C47.2 14.37,34.16 14.37,33.44 14.68,33.12 17.68,33.12 24.77,25.22 IC1.3
AIN7P
  Top 0.254: R46.2 C46.1 14.34,31.31 14.66,30.99 17.96,30.99 24.26,24.69 IC1.4
AIN8N
  Top 0.254: R49.2 C49.2 14.26,37.68 14.58,37.36 17.96,37.36 25.73,26.21 IC1.1
AIN8P
  Top 0.254: R48.2 C48.1 14.29,35.6 14.61,35.28 17.88,35.28 25.3,25.73 IC1.2
ARD_SCL  (via drill 0.38)
  Top 0.203: v46.05,5.33 45.77,8.52 IC9.P$1
  Bottom 0.203: v46.05,5.33 47.22,4.24 91.92,4.34 93.51,5.44 99.14,5.44 100.81,7.21 100.84,37.52 98.5,39.75 98.48,47.63 96.99,49.38 95.62,49.4 95.1,48.88 95.1,47.36 94.58,46.84 87.47,46.86 86.23,48.25 JP22.8
ARD_SDA  (via drill 0.38)
  Top 0.203: v42.37,7.85 42.62,7.97 IC9.P$8
  Bottom 0.203: JP22.7 83.69,48.78 87.14,46.05 90.27,46.05 92.02,44.3 94.6,44.32 95.12,44.84 95.12,46.34 95.64,46.86 97.68,46.86 97.94,46.52 97.94,39.39 100.13,37.26 100.13,7.42 98.76,5.97 93.22,5.97 91.21,4.75 48.04,4.78 arc-45 47.81,4.87 46.51,6.38 44.68,7.6 v42.37,7.85
AVDD  (via drill 0.38, 0.51, 0.6)
  Top 0.203: 31.02,26.49 30.49,26.37 | 31.02,26.49 31.24,26.54 IC1.59 | IC1.54 33.74,27.11 32.87,26.29 33.12,26.49 32.59,26.49 | 32.59,26.49 31.02,26.49 | 30.71,18.55 30.46,18.57 v30.45,18.67 | v30.45,18.68 30.4,23.3 30.4,23.53 | IC1.56 32.74,26.64 32.59,26.49
  Top 0.254: IC1.22 31.24,18.52 30.71,18.55 IC1.21 | IC1.19 29.74,17.96 v30.45,18.67 | 30.49,26.37 30.4,26.28 30.4,23.3
  Top 0.305: C10.1 27.5,27.86 28.8,26.42 28.8,24.99 30.27,23.53 30.4,23.53 | 30.4,23.53
  Top 0.356: C10.1 C9.1 27.5,33.44 27.48,34.38 27.48,34.88 26.63,35.73 26.55,38.87 27.5,39.61 27.81,39.93 C50.1 28.74,40.88 29.06,41.2 30.54,41.2 30.86,41.52 30.86,43.81 31.18,44.13 IC8.5
  Top 0.406: C8.1 38.33,28.85 37.08,27.58 35.2,25.82 33.27,25.83 32.87,26.29 | 85.97,40.89 C33.1 | C11.1 v24.69,12.8 C12.1 | v30.45,18.67 v30.45,18.68 | v17.76,3.43 16.43,5.56 9.75,5.56 7.85,3.33 5.99,3.33 4.34,4.97 JP16.2
  Top 0.61: C8.1 C7.1 v41.12,35.23 | v84.61,40.89 85.97,40.89 | JP4.2 TP1.1 | v47.69,37.49 C60.1 46.54,40.7 46.23,41.02 45.85,41.02 45.53,41.34 R23.1 IC7.5
  Bottom 0.406: v24.69,12.8 24.49,12.12 v17.76,3.43
  Bottom 0.61: v84.61,40.89 83.59,39.09 65.91,39.09 TP1.1 | v24.69,12.8 25.38,13.23 v30.45,18.67
  Bottom 0.889: JP4.2 v47.69,37.49 45.54,34.85 v41.12,35.23
  pour Top: 30.05,26.29 30.05,18.26 30.15,18.16 31.34,18.16 31.47,18.26 31.47,18.77 31.37,18.87 30.96,18.87 30.76,19.08 30.76,25.25 31.06,25.63 33.6,25.65 34.29,25.86 33.76,26.31 33.48,26.8 32.94,26.8 32.74,27 32.49,26.8 31.47,26.8 31.24,27 30.96,26.7 30.35,26.7
AVSS  (via drill 0.38, 0.41, 0.51, 0.59, 0.6)
  Top 0.203: 33.2,20.7 33.5,20.19 33.6,20.04 34.52,18.57 35.03,18.36 35.23,18.36 36.2,17.4 36.2,16.64 IC1.32 | IC1.58 31.74,29.65 v31.98,29.82 32.24,29.64 IC1.57 | IC1.53 34.24,29.92 v34.24,30.91
  Top 0.254: IC1.23 31.74,15.76 31.29,15.32 | IC1.20 30.24,15.48 28.8,14.05 | IC1.25 32.74,17.84
  Top 0.305: 28.8,14.05 29.44,14.05 30.25,14.86 30.84,14.86 31.29,15.32 | 32.74,17.84 v32.71,18.67
  Top 0.356: C29.2 C30.2 v30.8,31.09 | v34.24,30.91 35.74,30.91 36.05,31.23 C20.2 36.08,32.31 C19.2 | IC7.2 v42.88,46.18
  Top 0.406: C18.2 37.08,10.38 36.77,10.06 C17.2 | C8.2 41.11,28.05 40.79,27.74 38.25,27.74 35.49,25.06 34.65,25.06 v32.74,23.37 | v32.69,21.29 33.2,20.7 | 28.8,14.05 v28.45,14.05 C11.2 C12.2 C22.2 v29.99,11.99 C23.2 | R22.2 v46.86,46.76 | C61.2 v41.12,36.8 | TP2.1 C51.2 29.25,45.3 28.93,45.09 27.43,45.09 27,44.75 27,43.5 27.39,43.18 IC8.2
  Top 0.61: C8.2 C7.2 43.15,33.06 v43.15,33.2 | JP5.2 87.67,42.85 C33.2 | C21.2 v32.55,9.91 C17.2
  Bottom 0.356: v41.12,36.8 40.1,37.43
  Bottom 0.61: v42.88,46.18 42.88,47.07 | 46.76,47.07 v46.86,46.76 46.79,46.84 46.79,47.07 | 69.06,47.12 81.92,47.17 87,42.32 JP5.2 | 39.14,47.04 36.88,45.47 TP2.1 | v34.24,30.91 v31.98,29.82 | 40.77,38.68 40.89,38.87 | 32.63,23.81 v32.74,23.37
  Bottom 0.889: 39.14,47.04 42.88,47.07 45.16,47.07 | 45.16,47.07 46.76,47.07 | 46.79,47.07 69.06,47.12 | 45.16,47.07 43.71,43.28 40.89,38.87 | v30.8,31.09 v31.98,29.82 31.9,25.55 32.63,23.81 | v43.15,33.2 40.21,33.5 39.19,35.74 40.1,37.43 40.77,38.68 | v32.74,23.37 v32.69,21.29 v32.71,18.67 32.71,18.11 v28.45,14.05 30.55,13.35 32.49,11.22 v32.55,9.91
  pour Top: 35.45,25.27 35.69,25.01 33.99,23.06 34.04,20.22 35.15,18.59 35.56,18.08 34.44,18.11 33.81,18.52 33.53,19.3 32.21,19.74 31.67,20.6 31.67,23.34 32.87,25.28
  pour Bottom: 41.73,47.12 43.76,43.56 45.39,47.12
  pour Top: 30.05,15.42 31.37,15.42 29.74,13.89 28.42,13.89
  pour Bottom: 39.6,36.45 41.61,36.55 40.51,38.07
  pour Bottom: 31.27,30.56 32.38,30.45 38.89,33.6 39.4,34.82 39.4,34.92 40.31,33.4 31.98,29.44
BIAS_ELEC  (via drill 0.38)
  Top 0.305: v26.43,34.01 JP9.1
  Top 0.356: JP6.1 36.2,38.28 34.62,39.65 34.62,43.04 36.15,45.01 39,45.01 39.25,45.26 R24.2
  Bottom 0.356: JP6.1 37.31,36.96 37.31,34.34 36.01,33.33 30.71,33.4 27.39,33.36 v26.43,34.01
BIAS_ELEC_CON  (via drill 0.38)
  Top 0.305: R24.1 34.87,47.14 21.39,47.12 v9.22,42.42
  Bottom 0.254: v9.22,42.42 5.66,40.32
  Bottom 0.305: JP16.24 5.66,35.86 5.66,40.32
BIASIN  (via drill 0.38)
  Top 0.203: v29.7,30.32 29.72,28.32
  Top 0.279: 29.72,28.32 IC1.62
  Top 0.305: JP9.3 20.16,36.14 v23.25,32.24
  Bottom 0.305: v23.25,32.24 25.2,31.1 28.88,31.11 v29.7,30.32
BIASINV  (via drill 0.38)
  Top 0.203: 30.68,29.87 30.24,29.3 IC1.61
  Top 0.254: IC1.61 30.23,27.25 v29.57,26.7
  Top 0.305: 30.68,29.87 32.79,31.83 32.82,35.19 R6.1 v34.3,36.46
  Top 0.406: C66.2 29.26,36.79 30.79,36.94 R6.1
  Bottom 0.254: v29.57,26.7 30.89,24.11 30.89,21.11 27.41,17.48 24.69,16.05 19.79,9.29 17.88,5.51 9.73,5.54
  Bottom 0.305: v34.3,36.46 33.65,41.92 27.69,47.14 24.13,47.12 14.73,43.76 9.75,43.66 JP15.1 | 9.73,5.54 9.19,6.07 9.19,6.84 JP16.3
BIASOUT  (via drill 0.38)
  Top 0.203: 29.01,29.64 29.24,29.44 IC1.63
  Top 0.254: C66.1 28.04,37.16 28.04,34.99 28.7,34.33 28.78,29.85 29.01,29.64
  Top 0.406: R6.2 32.37,38.24 C66.1 28.89,38.25 v27.45,38.23
  Bottom 0.406: v27.45,38.23 27.59,38.23 23.83,38.23 JP9.2
BOARD_ADDR_0  (via drill 0.38)
  Top 0.152: 38.23,23.24 IC1.42
  Top 0.203: JP3.3 66.02,13.8 65.7,13.49 58.88,13.49 58.56,13.17 R19.2 58.56,13.73 v57.78,14.5 57.07,13.59 48.59,13.64 v47.88,14.05 | 38.23,23.24 37.39,23.27 37.06,23.5 35.5,23.5 35.18,23.18 v35.18,21.89
  Top 0.254: v57.28,6.38 57.07,6.79 56.76,7.11 IC5.1
  Bottom 0.254: v47.88,14.05 38.14,13.77 35.18,16.04 v35.18,21.89 | v57.78,14.5 59.82,11.76 59.71,7.29 v57.28,6.38
  pour Top: 58.39,13.89 58.6,12.88 59.21,13.49
BOARD_ADDR_1  (via drill 0.38)
  Top 0.152: 38.48,24.26 IC1.44
  Top 0.203: 38.48,24.26 40.26,24.26 v41.17,24.59
  Top 0.254: R20.2 58.74,6.57 59.06,6.25 62.42,6.25 62.84,6.57 62.84,10.63 63.16,10.95 64.72,10.95 JP3.1
  Top 0.305: v52.63,8.25 55.13,8.31 IC5.2 57.82,8.38 R20.2
  Bottom 0.254: v41.17,24.59 41.2,27.46 41.22,29.03 41.68,29.85 43.41,30.46 45.59,29.85 53.21,22.76 53.54,19.84 53.72,16.08 53.82,11.18 v52.63,8.25
BOARD_ADDR_2  (via drill 0.38)
  Top 0.152: 38.35,24.69 IC1.45
  Top 0.203: 38.35,24.69 39.29,24.69 40.44,25.32 41.15,25.86 v42.21,25.96 | v52.04,11.91 56.6,11.91 57.02,11.59 57.02,10.9 R21.2
  Top 0.305: IC5.3 R21.2
  Bottom 0.254: v42.21,25.96 42.75,25.83 46.74,25.86 50.65,22.43 50.7,14.68 51.71,13.21 v52.04,11.91
CLK
  Top 0.203: IC10.6 47.86,28.76 41.35,21.29 40.34,20.7 IC1.37
CLKSEL  (via drill 0.38)
  Top 0.152: v47.37,31.88 48.64,31.88 IC10.1 | 34.77,28.32 IC1.52
  Top 0.203: 34.77,28.32 34.75,29.31 v35.2,30.02
  Bottom 0.254: v47.37,31.88 41.93,31.67 37.87,27.92 36.3,27.92 v35.2,30.02
DRDY
  Top 0.203: IC10.3 47.37,30.71 43.87,27.92 39.77,25.68 IC1.47
DVDD  (via drill 0.38)
  Top 0.152: 49.91,33.91 C52.2 49.66,33.65 | 49.91,35.94 C53.2 | 47.88,33.65 47.88,33.4 R2.1
  Top 0.203: IC10.2 48.88,31.37 v50.27,31.37 | v50.11,24.08 50.07,24.12 IC11.2 | IC1.48 39.21,26.2 v40.16,26.85 | IC1.50 35.74,29.23 v37.67,30.76 | R2.1 47.73,33.1 | 49.34,15 C56.2 | 49.39,16.65 C57.2 | R3.1 44.68,15.33 v44.68,17.14 | IC9.P$3 44.38,9.77 v44.02,10.64
  Top 0.305: R1.1 v25.48,6.07 | 47.73,33.1 v46.2,33.1 | 49.34,15 v48.08,15.77 49.39,16.65 | C13.1 v40.61,14.73 C14.1 | 49.91,35.94 49.91,33.91 | 47.88,33.65 49.66,33.65 | IC5.8 51.43,7.11 v52.65,6.33 | R4.1 44.81,6.21 v44.47,5.11 | C70.2 v39.22,11.86 C71.2
  Top 0.356: C25.1 v61.24,33.73 C63.1
  DVDD 0.203: v40.61,14.73 40.61,14.71
  Bottom 0.305: v44.68,17.14 47.95,15.8 v48.08,15.77
  pour DVDD (isolate 0.305): 0.2,52.27 0.2,1.07 arc90 0.97,0.2 98.12,0.2 arc90 98.86,1.04 98.86,2.64 101.4,5.18 101.4,37.74 98.86,40.28 98.86,51.71 97.43,53.14 1.09,53.14 arc90
GPIO4  (via drill 0.38)
  Top 0.254: IC1.46 37.19,25.2 v36.45,24.46
  Top 0.305: v24.16,9.35 21.95,9.35 21.42,8.72 R18.1
  Bottom 0.254: v36.45,24.46 33.81,22.55 33.88,15.19 33.92,9.35 33.9,8.36 30.53,5.38 27.41,5.39
  Bottom 0.305: 27.41,5.39 v24.16,9.35
IN1N
  Top 0.254: R35.1 8.7,11.54 8.7,14.51 7.8,15.41 5.53,15.41 JP16.8
IN1P
  Top 0.254: R34.1 8.1,10.1 8.1,13.01 JP16.7
IN2N
  Top 0.254: 7.77,17.9 9,16.67 9,16.25 10.11,15.14 10.11,13.43 10.43,13.11 R37.1 | 7.77,17.9 7.63,18.04 5.62,18.04 JP16.10 | 7.77,17.9
IN2P
  Top 0.254: R36.1 10.28,11.07 9.46,11.89 9.46,14.74 7.44,16.76 JP16.9
IN3N
  Top 0.254: JP16.12 5.53,20.49 7.97,20.49 11.16,17.29 R39.1
IN3P
  Top 0.254: JP16.11 7.72,19.3 10.25,16.78 10.25,16.05 R38.1
IN4N
  Top 0.254: JP16.14 5.53,23.03 8.43,23.03 10.2,21.26 R41.1
IN4P
  Top 0.254: R40.1 10.66,19.2 8.02,21.84 JP16.13
IN5N
  Top 0.254: JP16.16 5.61,25.65 10.9,25.65 R43.1
IN5P
  Top 0.254: JP16.15 8.68,24.38 9.75,23.32 R42.1
IN6N
  Top 0.254: R45.1 9.83,29.97 9.8,29.97 7.99,28.16 5.58,28.16 JP16.18
IN6P
  Top 0.254: R44.1 10.04,27.92 9.96,27.92 8.96,26.92 JP16.17
IN7N
  Top 0.254: R47.1 10.53,34.19 9.4,33.06 9.4,32.55 7.6,30.75 5.58,30.75 4.34,29.51 JP16.20
IN7P
  Top 0.254: R46.1 10,32.11 7.36,29.46 JP16.19
IN8N
  Top 0.254: R49.1 9.64,38.46 8.38,37.19 8.38,34.3 7.35,33.28 5.62,33.28 JP16.22
IN8P
  Top 0.254: R48.1 9.44,36.32 9.12,36 9.12,34.11 7.01,32 JP16.21
IOREF  (via drill 0.38)
  Top 0.152: 55.24,35.94 C55.2
  Top 0.203: C59.2 54.29,16.79
  Top 0.305: 54.29,16.79 C58.2 v55.93,14.66 | JP26.2 32.21,4.6 37.84,4.6 38.16,4.91 C73.2 C72.2 41.13,5.78 41.48,6.17 41.45,9.27 | C59.2 54.27,17.62 53.21,18.67 53.21,23.8 53.53,24.12 IC11.19 57.24,24.12 v57.89,24.33 | IC10.19 54.7,31.37 v52.6,31.37 | 55.24,35.94 55.14,35.84 v55.14,34.82 C54.2 | 41.45,9.27 41.45,12.59 41.77,12.9 v45.72,12.9 | IC9.P$7 41.45,9.27 | v50.37,12.88 v57.43,12.9
  Bottom 0.305: v57.89,24.33 57.25,26.72 v52.6,31.37 v55.14,34.82 | v55.93,14.66 v57.43,12.9 | v45.72,12.9 48.16,13.11 v50.37,12.88
  pour Top: 41.43,9.83 41.43,8.61 41.99,9.25
N$1
  Top 0.152: 66.02,44.63 C4.1 | 66.42,42.8 L2.1
  Top 0.406: 66.47,42.44 L2.1 | 66.42,42.8 66.02,44.63 | C5.1 C4.1
  Top 0.61: 66.47,42.44 68,42.44 IC3.5
N$2
  Top 0.406: C2.1 L1.1 | IC2.5 C1.1
  Top 0.61: L1.1 80.23,43.09 IC2.5
N$3
  Top 0.254: IC1.28 34.24,15.49
  Top 0.406: 34.24,15.49 34.24,14.47 C17.1
N$4
  Top 0.254: IC1.30 35.24,14.99
  Top 0.406: 35.24,14.99 C18.1
N$5
  Top 0.203: 33.25,29.85 IC1.55
  Top 0.356: C19.1 C20.1 33.24,31.27 33.25,29.85
N$7
  Top 0.254: 52.16,41.16 IC6.1
  Top 0.406: C15.1 57.53,46.61 57.53,46.8 57.21,47.12 49.71,47.12 48.56,45.7 48.54,41.36 49.09,40.84 51.84,40.84 52.16,41.16
  Top 0.61: L3.1 C15.1 C16.1
N$8
  Top 0.254: IC1.26 33.24,15.49
  Top 0.356: 33.24,15.49 C21.1
N$9
  Top 0.406: C26.2 49.78,45.96 50.1,46.28 51.84,46.28 52.16,45.96 IC6.5
N$10
  Top 0.152: 49.91,42.8 C26.1
  Top 0.406: 49.91,42.8 50.82,42.8 51.97,43.74 53.66,43.76 53.95,43.5 53.97,42.54 IC6.3
N$11
  Top 0.305: C32.1 66.37,47.73 71.01,47.73 71.7,46.85 71.7,45.88 71.18,45.14 68.64,45.14 68.3,44.87 IC3.4
N$12
  cutout AGND: 63.93,7.57 63.96,7.62 arc180
N$13
  Top 0.406: C31.1 81.38,46.8 IC2.4
N$14
  Top 0.152: 19.69,7.49 R18.2
  Top 0.305: D2.A 19.69,7.49
N$15
  Top 0.356: R22.1 45.76,43.78 45.44,44.09 45.44,46.93 45.1,47.19 42.24,47.19 41.92,46.8 IC7.3
  Top 0.406: R22.1 R23.2
N$16
  Top 0.406: IC8.3 28.12,42.24 27.6,41.98 24.38,42 JP7.2
N$17  (via drill 0.38, 0.41)
  Top 0.356: v32.31,41.15 32.09,41.38 IC8.4
  Top 0.406: IC8.1 v28.12,44.12
  Bottom 0.305: v32.31,41.15 28.09,44.14 28.12,44.17 | JP8.3 v28.12,44.12
  Bottom 0.406: v28.12,44.12 28.12,44.17
N$18
  Top 0.356: IC7.1 43.82,44.23 43.51,43.48 42.24,43.48 41.92,43.02 IC7.4
  Top 0.61: JP6.3 39.06,43.33 39.81,42.59 IC7.4
N$19
  Top 0.152: 23.75,7.24 R1.2 | 23.75,5.21 D1.A
  Top 0.305: 23.75,5.21 23.75,7.24
N$23
  cutout DVDD: 63.93,7.57 63.96,7.62 arc180
N$26
  cutout DVDD: 98.6,2.59 98.58,2.49 arc180
N$37
  Top 0.203: IC9.P$6 43.14,9.77 43.46,9.46 43.46,7.9 43.04,7.48 R4.2
N$55
  cutout AGND: 98.63,2.57 98.6,2.46 arc180
N$561  (via drill 0.38)
  Top 0.152: 48.74,26.19 IC10.10 | 47.62,34.92 R2.2
  Top 0.203: v47.73,26.19 48.74,26.19
  Top 0.305: v43.13,28.78 45.21,30.66 45.21,33.17 46.53,34.92 47.62,34.92
  Bottom 0.305: v47.73,26.19 44.78,28.78 v43.13,28.78
N$562
  Top 0.152: 48.77,18.92 IC11.10
  Top 0.203: 48.77,18.92 43.26,18.92 42.94,18.61 R3.2
REF_ELEC
  Top 0.152: 15.33,40.81 C62.1
  Top 0.305: R25.1 14.9,40.82 C62.1 | 20.12,40.28 15.33,40.81 | JP7.1 20.12,40.28 | 20.12,40.28 20.02,40.36 JP8.1
REF_ELEC_CON
  Top 0.254: R25.2 5.89,40.82 5.64,40.56 5.64,35.79 JP16.23
SCL  (via drill 0.38)
  Top 0.254: IC5.6 48.63,9.65 48.28,9.97 v48.01,10.21 | v45.52,11.25 IC9.P$4
  Bottom 0.254: v48.01,10.21 v45.52,11.25
SDA  (via drill 0.38)
  Top 0.203: IC9.P$5 42.65,10.3
  Top 0.254: 42.65,10.3 v42.65,12.06 | v48.11,12.06 49.69,12.06 50,11.75 IC5.5
  Bottom 0.254: v42.65,12.06 v48.11,12.06
SPI0_MISO
  Top 0.203: SPI.1 63.5,32.6 64.05,33.12 77.23,33.12 77.65,32.63 JP2.2
SPI0_MOSI
  Top 0.203: SPI.4 65,28.85 65,31.84 65.32,32.31 75.86,32.31 76.2,31.92 76.2,23.37 76.56,21.69 76.56,11.05 JP2.18
SPI0_SCK
  Top 0.203: JP2.8 76.56,23.85 76.56,32.37 76.11,32.71 64.91,32.71 64.57,32.37 64.57,28.88 SPI.3
SPI_CLK
  Top 0.203: IC10.5 47.72,29.41 42.14,23.19 39.09,22.2 IC1.40
SPI_IN
  Top 0.203: IC10.7 48.1,28.11 41.3,19.2 IC1.34
SPI_OUT
  Top 0.203: IC10.4 47.46,30.06 41.66,23.7 IC1.43
SRB1  (via drill 0.38)
  Top 0.152: 29.23,16.33 IC1.18
  Top 0.254: 29.23,16.33 29.23,15.62 28.96,15.39 28.41,15.39 28.09,15.73 28.07,26.26 27.15,27.18 25.81,27.61 24.4,29.37 24.2,31.94 23.83,34.89 | 23.83,34.89 22.48,34.89 21.4,35.99 21.43,38.54 JP8.2 | 23.83,34.89 v23.89,34.92
  Bottom 0.356: v23.89,34.92 24.31,34.94 30.02,34.95 34.81,34.93 35.13,35.24 35.13,39.9 35.84,40.79 JP6.2
SRB2  (via drill 0.38)
  Top 0.203: v29.13,21.21 28.74,19.8 IC1.17
  Bottom 0.254: JP7.3 23.66,42.07 22.46,42.05 21.41,40.97 21.38,39.77 21.38,39.07 21.42,38.26 21.4,35.71 21.45,34.3 22.26,31.93 24.28,29.52 25.91,27.53 27.1,27.23 29.11,25.22 v29.13,21.21
START  (via drill 0.38)
  Top 0.203: IC11.3 48.87,23.5 v46.08,23.5 | v40.46,21.74 39.92,21.2 IC1.38
  Bottom 0.305: v46.08,23.5 v40.46,21.74
USART1_MISO
  Top 0.203: JP2.4 77.57,27.69 78.92,28.85 78.94,36.69 78.27,37.36 76.89,37.36 74.65,39.6 74.65,45.09 72.26,47.47 72.26,51.78 72.56,52.09 75.88,52.09 76.07,51.88 JP22.4
USART1_MOSI
  Top 0.203: JP2.20 80.3,7.47 80.92,8.32 80.9,37.1 79.67,38.1 77.27,38.1 75.46,39.9 75.46,45.26 73.53,47.19 JP22.3
USART1_SCK
  Top 0.203: JP25.1 50.67,4.38 50.94,4.78 68.07,4.78 69.06,5.87 75.91,5.87 76.38,6.21 76.38,8.19 76.85,8.79 78.68,8.79 79.96,9.94 80.01,23.14 JP2.6
VCC_5V  (via drill 0.61)
  Top 0.406: 74.03,35.51 C27.1
  Top 0.61: v76.61,35.48 C27.1 | L4.1 74.03,35.51
  Bottom 0.61: SPI.2 69.77,30.35 v76.61,35.48
VCC_5V_FILTERED
  Top 0.406: 53.11,39.6 IC6.2 | C64.1 53.18,39.53 53.11,39.6 | IC3.3 71.79,44.28 72.11,43.96 72.11,42.7 71.79,42.38 IC3.1 | C68.1 53.11,39.6
  Top 0.61: C64.1 C65.1 JP4.1 63.32,38.1 69.39,38.1 L4.2 70.87,37.98 IC3.1
  pour Top: 69.98,37.97 70.89,38.99 71.5,37.87
VCC_-5V  (via drill 0.38)
  Top 0.152: 61.09,46.61 L3.2
  Top 0.305: C24.1 58.19,41.93
  Top 0.406: 58.19,41.93 v58.9,42.65 | C28.1 87.08,45.49 86.59,44.99 IC2.3 | IC2.3 83.73,44.99 v82.68,44.93 | IC2.2 IC2.3
  Top 0.61: 61.09,46.61 v62.23,45.87
  Bottom 0.406: 82.5,44.88 v82.68,44.93 | 62.33,45.85 v62.23,45.87 59.78,45.85 58.9,44.74 v58.9,42.65
  Bottom 0.61: 82.5,44.88 63.8,44.88 62.33,45.85
VREFP
  Top 0.254: IC1.24 32.24,15.4
  Top 0.305: C22.1 C23.1 31.25,9.15 31.27,14 32.24,15.4
  Top 0.61: C22.1 TP4.1
(copper drawn outside any net)
  shapes: Bottom circle x1

## Text on the board
Top: Layer 1 / Top signal
AGND: Layer 2 / GND (-)
DVDD: Layer 3 / DVDD (+)
Bottom: c 2013-2020 / Adam Feuer / Starcat LLC | Layer 4 / Bottom signal
tPlace: 5V | GND | SCL1 | SDA1 | AREF | GND | 13 | 12 | 11 | 10 | 9 | 8 | 7 | 6 | 5 | 4 | 3 | 2 | 1 | 0 | 14 | 15 | 16 | 17 | 18 | 19 | 20 | 21 | 22 | SCLK | 23 | 24 | START | Ext. / Sync | 3 | 25 | BIASINV | 26 | 1 | 2 | 3 | AVSS | 3 | 3 | 27 | 2 | 2 | 2 | 28 | 1 | 29 | 1 | 30 | 1 | AVDD | A | B | 31 | 32 | 3 | 2 | 1 | AGND | 12 | 33 | 24 | 23 | 34 | A | B | PWDN | 11 | 35 | 36 | MISO | 5V | 10 | 10 | 37 | 38 | SPI / MISO | 9 | 9 | SCK | MOSI | RESET | 39 | 40 | 8 | 8 | 41 | RST | GND | 42 | v1.5.0 GA | SPI / CLK | 7 | START | 7 | A | B | 43 | 44 | 6 | 6 | 45 | Electrodes | 5 | CLK | 46 | Jumper / Storage | 5 | 47 | 48 | 0 | SPI CS | 4 | 4 | 49 | 50 | 1 | 3 | 3 | 51 | 52 | Board Addr | 2 | DRDY | 2 | 53 | GND | GND | SPI / MOSI | HackEEG Shield | 2 | 1 | 1 | 1 | VREFP | 5V | GND | GND | VIN | IOREF | RESET | 3V3 | A0 | A1 | A2 | A3 | A4 | A5 | A6 | A7 | A8 | A9 | A10 | A11 | DAC / 0 | DAC / 1 | CAN / RX | CAN / TX | GPIO4 | Power
bPlace: Released under the CERN / Open Hardware License v.1.2